# EAGLE design PowerOn (EAGLE 7.1.0)
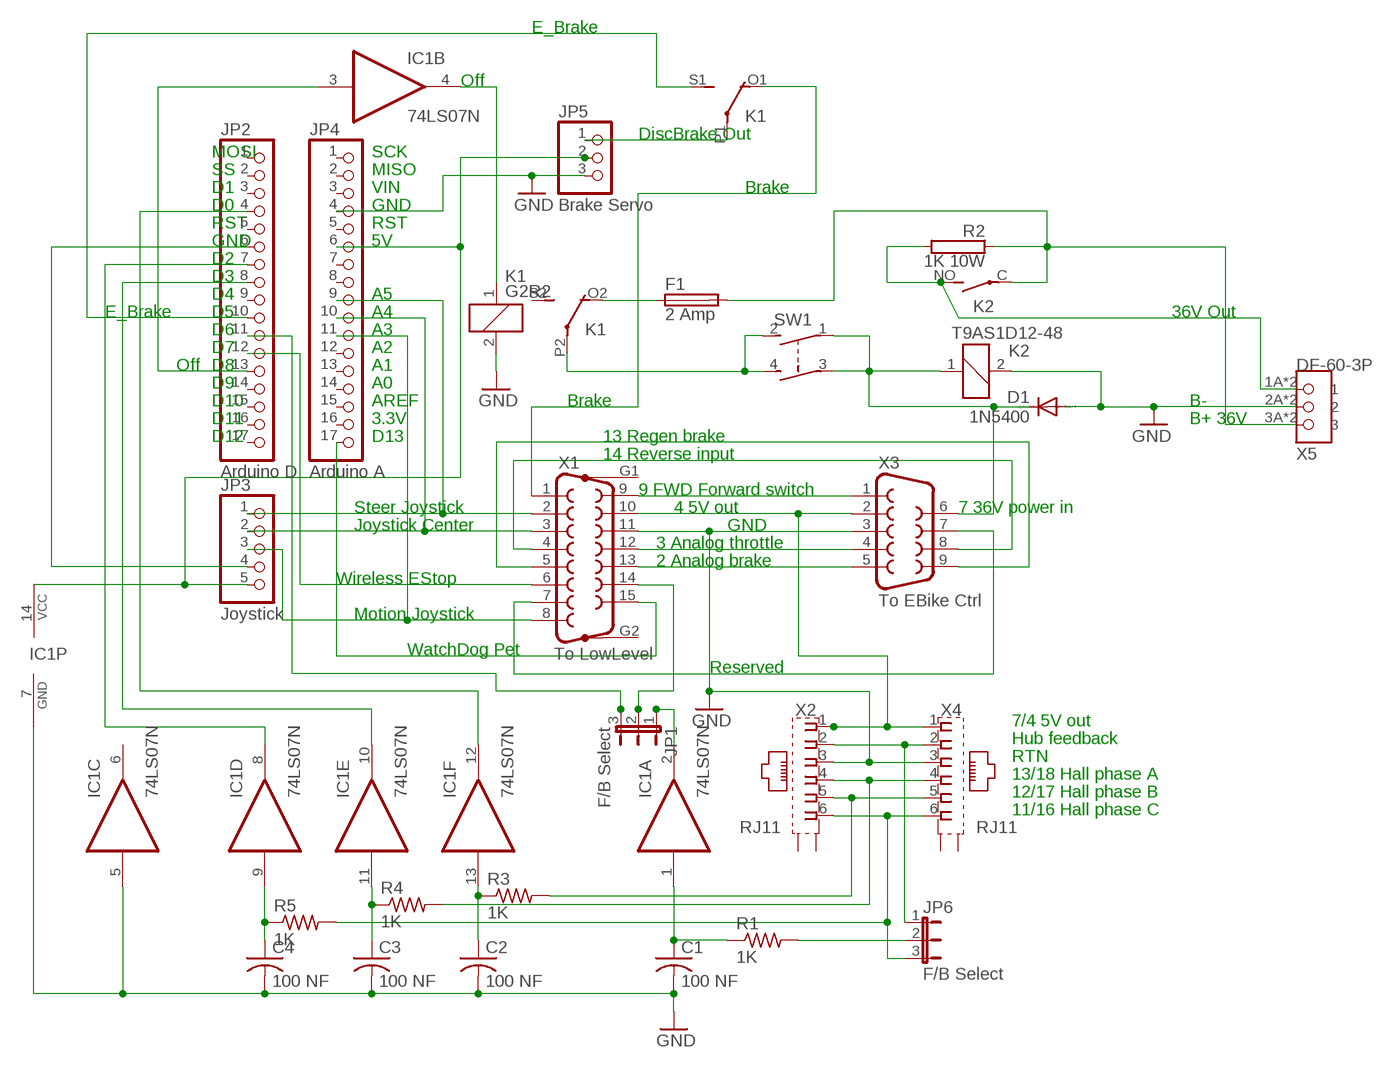
[diagram p0: schematic, sheet 1]

## Parts
C1  100 NF  C-US050-050X075  [C050-050X075]
C2  100 NF  C-US050-024X044  [C050-024X044]
C3  100 NF  C-US050-024X044  [C050-024X044]
C4  100 NF  C-US050-024X044  [C050-024X044]
D1  1N5400  [DO201-15]
F1  2 Amp  SH22,5  [SH22,5]
IC1  74LS07N  [DIL14]
JP1  F/B Select  JP2E  [JP2]
JP2  Arduino D  PINHD-1X17  [1X17]
JP3  Joystick  PINHD-1X5/90  [1X05/90]
JP4  Arduino A  PINHD-1X17  [1X17]
JP5  Brake Servo  PINHD-1X3/90  [1X03/90]
JP6  F/B Select  JP2E  [JP2]
K1  G2R2  [G2R2]
K2  T9AS1D12-48  JT1A-PCB-DC24V  [JT1A-PCB]
R1  1K  R-US_0411/15  [0411/15]
R2  1K 10W  RAC07  [AC07]
R3  1K  R-US_0207/10  [0207/10]
R4  1K  R-US_0207/10  [0207/10]
R5  1K  R-US_0207/10  [0207/10]
SW1  CK-S201  [CK-S201]
X1  To LowLevel  F15HP  [F15HP]
X2  RJ11  XRJK-S-01-6-6-0-2G2-NO  [XRJK-S-01-6-6-0-2G2-NO]
X3  To EBike Ctrl  F09H  [F09H]
X4  RJ11  XRJK-S-01-6-6-0-2G2-NO  [XRJK-S-01-6-6-0-2G2-NO]
X5  HIROSE-DF60-3P-10.16DSA  [DF-60-3P-10.16]

## Nets
36V_BAT: F1.2 K2.C(P) R2.1 X5.3A X5.3B
36V_CL: D1.C K2.1 SW1.1(P) SW1.3(P1) X3.6
36V_OUT: K2.NO(S) R2.2 X5.1A X5.1B
36V_SW: K1.P2(3:P) SW1.2(S) SW1.4(S1)
BRAKE: K1.O1(2:O) X1.1
BRK: X1.13 X3.5
BRK_OUT: JP5.1 K1.P1(2:P)
E_RQST: JP2.12 X1.6
EBRAKE: JP2.10 K1.S1(2:S)
F/B: JP1.2 X1.14
FB_SEL: JP6.2 R1.2
FWD: X1.9 X3.1
GND: C1.2 C2.2 C3.2 C4.2 D1.A IC1.5(C:I) IC1.7(P:GND) JP4.4 JP5.3 K1.2 K2.2 X1.11 X2.3 X3.3 X4.3 X5.2A X5.2B
GND2: JP2.6 JP3.4
HALLA: R4.2 X2.4 X4.4
HALLB: R3.2 X2.5 X4.5
HALLC: JP6.3 R5.2 X2.6 X4.6
JOY_CEN: JP3.2 JP4.10 X1.3
JOY_MOT: JP3.3 JP4.11 X1.8
JOY_STR: JP3.1 JP4.9 X1.2
LIVE: X1.10 X2.1 X3.2 X4.1
N$1: IC1.2(A:O) JP1.1
N$2: F1.1 K1.O2(3:O)
N$3: C2.1 IC1.13(F:I) R3.1
N$4: C3.1 IC1.11(E:I) R4.1
N$5: C4.1 IC1.9(D:I) R5.1
N$6: IC1.8(D:O) JP2.7
N$7: IC1.10(E:O) JP2.8
N$8: IC1.12(F:O) JP2.4
N$9: JP1.3 JP2.11
OFF: IC1.3(B:I) JP2.13
OFF_DRV: IC1.4(B:O) K1.1
RESERVE: X1.7 X3.7
REV: X1.4 X3.8
RGN: X1.5 X3.9
SPD: C1.1 IC1.1(A:I) R1.1
SPEED: JP6.1 X2.2 X4.2
THROT: X1.12 X3.4
VCC: IC1.14(P:VCC) JP3.5 JP4.6 JP5.2
WDOG: JP4.17 X1.15
Unconnected: IC1.6(C:O) JP2.1 JP2.2 JP2.3 JP2.5 JP2.9 JP2.14 JP2.15 JP2.16 JP2.17 JP4.1 JP4.2 JP4.3 JP4.5 JP4.7 JP4.8 JP4.12 JP4.13 JP4.14 JP4.15 JP4.16 K1.S2(3:S) X1.G1 X1.G2 X2.S1(S) X2.S2(S) X4.S1(S) X4.S2(S)

## Notes on the sheet
- E_Brake
- Off
- DiscBrake Out
- MOSI | SCK
- SS | MISO
- D1 | VIN | Brake
- D0 | GND
- RST | RST
- GND | 5V
- D2
- D3
- D4 | A5
- E_Brake | D5 | A4 | 36V Out
- D6 | A3
- D7 | A2
- Off | D8 | A1
- D9 | A0
- D10 | AREF | Brake | B-
- D11 | 3.3V | B+ 36V
- D12 | D13 | 13 Regen brake
- 14 Reverse input
- 9 FWD Forward switch
- Steer Joystick | 4 5V out | 7 36V power in
- Joystick Center | GND
- 3 Analog throttle
- 2 Analog brake
- Wireless EStop
- Motion Joystick
- WatchDog Pet
- Reserved
- 7/4 5V out
- Hub feedback
- RTN
- 13/18 Hall phase A
- 12/17 Hall phase B
- 11/16 Hall phase C

## Library data of the parts
C1-C4 = rcl:C-US: CAPACITOR, American symbol
D1 = diode:1N5400: DIODE standard rectifier, 3 A, 50 V (Motorola)
F1 = fuse:SH22,5: FUSE HOLDER grid 22,5 mm, OGN0031 8201, Schurter (Buerklin); MF: SCHURTER; MPN: 0031.8201; OC_FARNELL: 1162740; OC_NEWARK: 96F8317
IC1 = 74xx-us:74*07: Hex BUFFER, open collector high-voltage output
JP1 JP6 = jumper:JP2E: JUMPER
JP2 JP4 = pinhead:PINHD-1X17: PIN HEADER
JP3 = pinhead:PINHD-1X5: PIN HEADER
JP5 = pinhead:PINHD-1X3: PIN HEADER
K1 = relay:G2R2: RELAY 2 x switch, Omron; MF: OMRON COMPONENTS USA; MPN: G2R-2-DC6; OC_FARNELL: unknown; OC_NEWARK: 89C5317
K2 = relay:JT1A?-*: COMPACT ECONOMICAL 30 AMP. RELAY NAiS Source: http://www.mew-europe.com/.. en_ds_61212_0000.pdf; OC_FARNELL: unknown; OC_NEWARK: unknown
R1 R3-R5 = rcl:R-US_: RESISTOR, American symbol
R2 = resistor-power:R: Power Resitor; OC_FARNELL: unknown; OC_NEWARK: unknown
SW1 = elcanoParts:CK-S201: DPST Slider switch
X1 = con-subd:F15HP: SUB-D; OC_FARNELL: unknown; OC_NEWARK: unknown
X2 X4 = con-xmultiple:XRJK*6: RJ11 Connector without LED, 6 position, 6 contacts, shielded, thrue hole Source: XRJK-S-01-6-6-0-2G2-NO(01).pdf
X3 = con-subd:F09: SUB-D; OC_FARNELL: unknown; OC_NEWARK: unknown
X5 = elcanoParts:HIROSE-DF60-3P-10.16DSA: 3 pin, 45Amp, 10.16mm pitch, board to Wire connector (UL, C-UL, TÜV certified product)

## Board
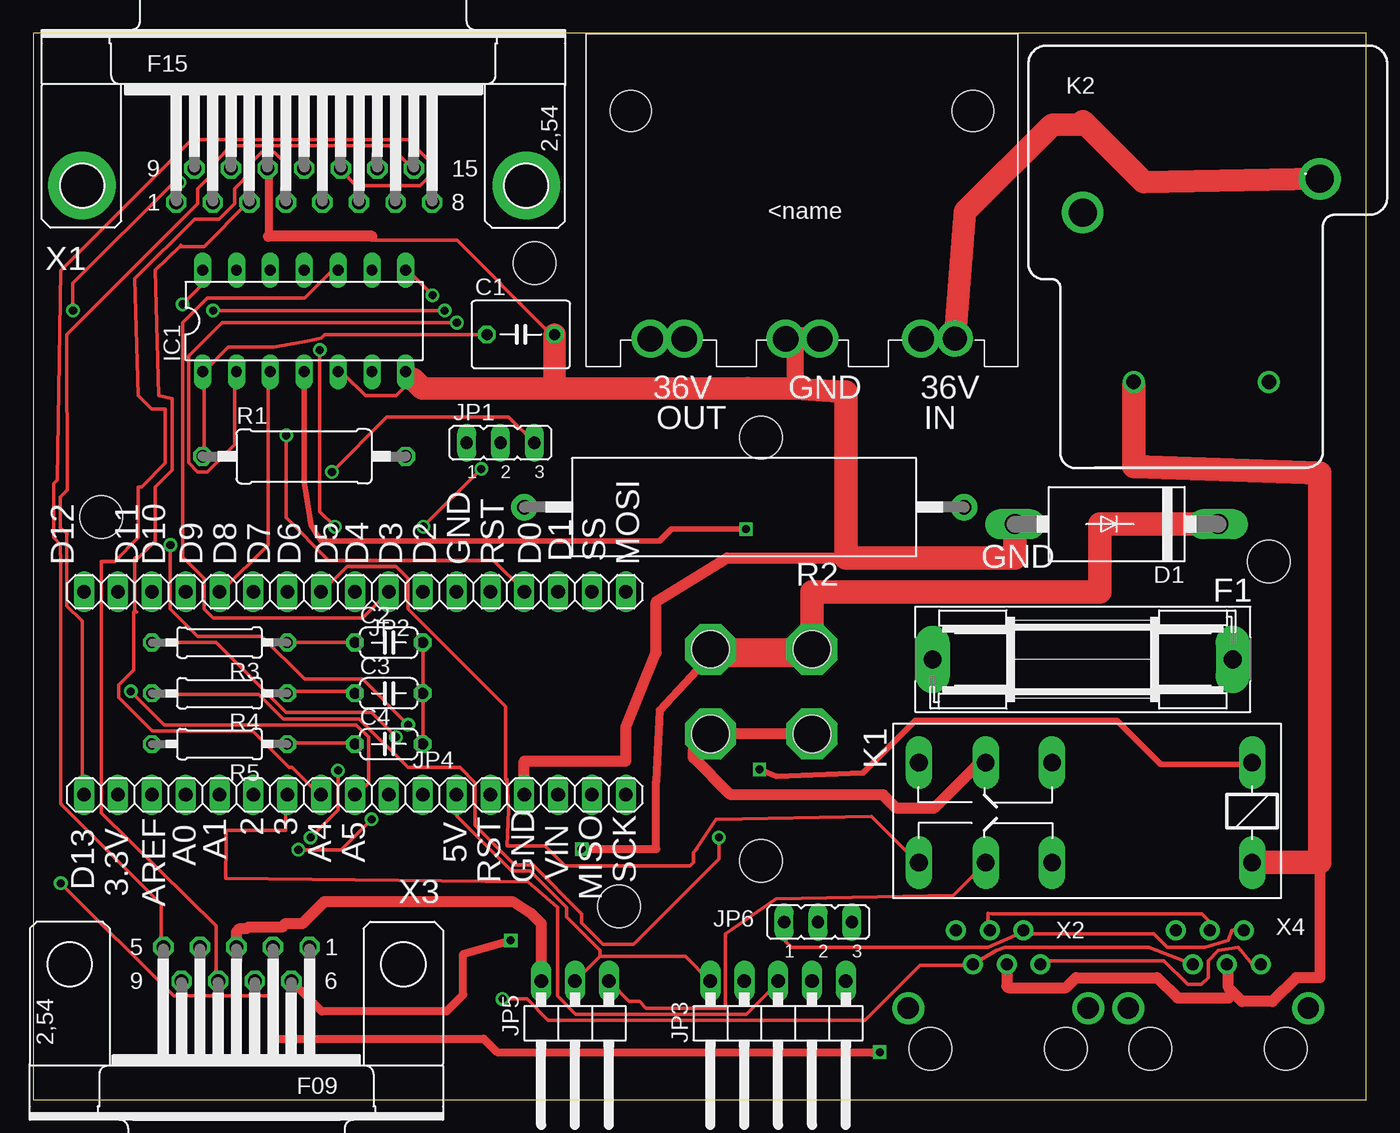
[diagram p1: board, top side]
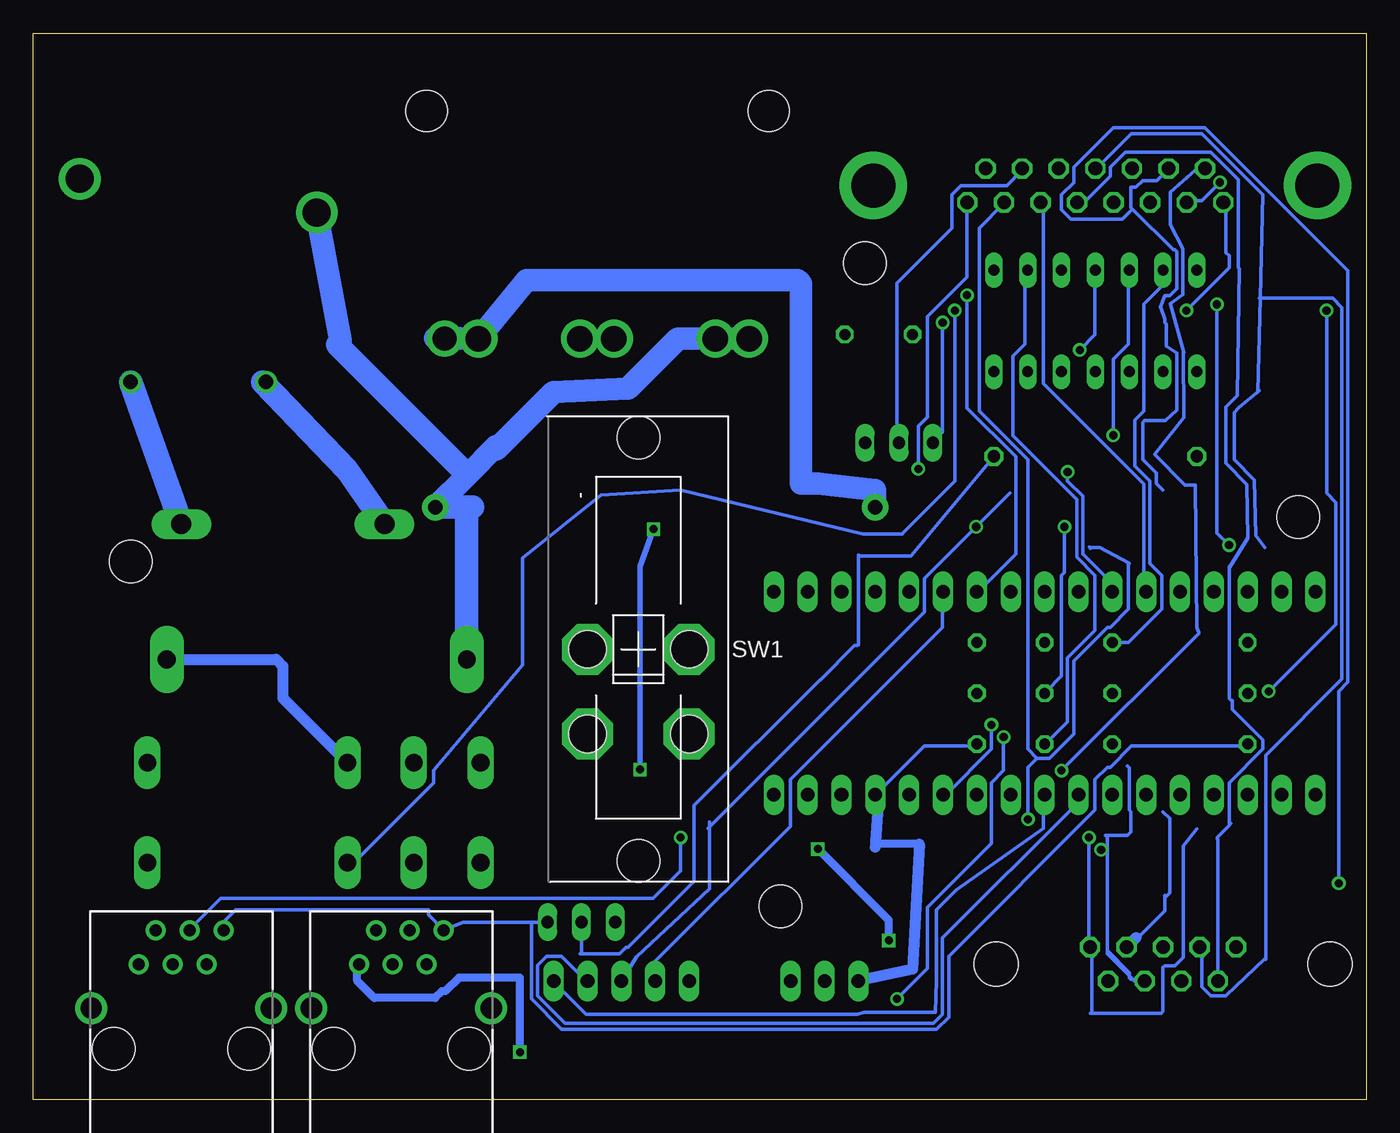
[diagram p2: board, bottom side, seen from below]

Size 100 x 80 mm. Coordinates in mm from the lower left corner, seen from the top.
Outline: 0,0 100,0 100,80 0,80 0,0
Copper layers (1*16): Top 0.035mm / dielectric 1.5mm / Bottom 0.035mm
Design rules "default": minimum track width 10mil, minimum drill 24mil, track to track 8mil, track to pad 8mil, pad to pad 8mil, via to via 8mil, smd to smd 8mil, copper to edge 40mil, drill to drill 8mil, minimum pad ring 10mil, minimum via ring 8mil, stop-mask expansion 4mil, vias tented up to drill 0mil, thermal gap 10mil
Holes 3.2 mm at 37.59,62.74 92.71,40.39 43.94,14.48 5.08,43.69

### Footprints (pad centres in the part's own frame; a part is rotated, then mirrored left to right if it is on the bottom)
C050-050X075 = drill 0.813 octagon: 1 -2.54,0; 2 2.54,0
C050-024X044 = drill 0.813 octagon: 1 -2.54,0; 2 2.54,0
DO201-15 = drill 1.499 long: A 7.62,0; C -7.62,0
SH22,5 = drill 1.321 pad 2.54 long: 1 -11.252,0; 2 11.252,0
DIL14 = drill 0.813 long: 1 -7.62,-3.81; 2 -5.08,-3.81; 3 -2.54,-3.81; 4 0,-3.81; 5 2.54,-3.81; 6 5.08,-3.81; 7 7.62,-3.81; 8 7.62,3.81; 9 5.08,3.81; 10 2.54,3.81; 11 0,3.81; 12 -2.54,3.81; 13 -5.08,3.81; 14 -7.62,3.81
JP2 = drill 0.914 long: 1 -2.54,0; 2 0,0; 3 2.54,0
1X17 = drill 1.016 long: 1 -20.32,0; 2 -17.78,0; 3 -15.24,0; 4 -12.7,0; 5 -10.16,0; 6 -7.62,0; 7 -5.08,0; 8 -2.54,0; 9 0,0; 10 2.54,0; 11 5.08,0; 12 7.62,0; 13 10.16,0; 14 12.7,0; 15 15.24,0; 16 17.78,0; 17 20.32,0
1X05/90 = drill 1.016 long: 1 -5.08,-3.81; 2 -2.54,-3.81; 3 0,-3.81; 4 2.54,-3.81; 5 5.08,-3.81
1X03/90 = drill 1.016 long: 1 -2.54,-3.81; 2 0,-3.81; 3 2.54,-3.81
G2R2 = drill 1.321 long: 1 -2.54,-3.683; 2 -2.54,3.81; O1 12.471,3.81; O2 12.471,-3.683; P1 17.45,3.81; P2 17.45,-3.683; S1 22.454,3.81; S2 22.454,-3.683
JT1A-PCB = drill 1.1: 1 5.08,0; 2 -5.08,0 | drill 2.1: C -8.89,12.7; NO 8.89,15.24
0411/15 = drill 0.914 octagon: 1 -7.62,0; 2 7.62,0
AC07 = drill 1.1 pad 2: 1 -16.5,0; 2 16.5,0
0207/10 = drill 0.813 octagon: 1 -5.08,0; 2 5.08,0
CK-S201 = drill 2.8 pad 3.81 octagon: 1 -3.81,0; 2 -3.81,-6.35; 3 3.81,0; 4 3.81,-6.35 | hole 3.2: 0,-15.875; 0,15.875 | hole 2.8: 3.81,-6.35; -3.81,-6.35; 3.81,0; -3.81,0
F15HP = drill 1.016 octagon: 1 -9.601,-1.27; 2 -6.858,-1.27; 3 -4.115,-1.27; 4 -1.372,-1.27; 5 1.372,-1.27; 6 4.115,-1.27; 7 6.858,-1.27; 8 9.601,-1.27; 9 -8.23,1.27; 10 -5.486,1.27; 11 -2.743,1.27; 12 0,1.27; 13 2.743,1.27; 14 5.486,1.27; 15 8.23,1.27 | drill 3.302 pad 5.08: G1 -16.662,0; G2 16.662,0
XRJK-S-01-6-6-0-2G2-NO = drill 0.9 pad 1.5: 1 -3.175,6.35; 2 -1.905,8.89; 3 -0.635,6.35; 4 0.635,8.89; 5 1.905,6.35; 6 3.175,8.89 | drill 1.6 pad 2.184: S1 -6.75,3.05; S2 6.75,3.05 | hole 3.2: -5.08,0; 5.08,0
F09H = drill 1.016 octagon: 1 -5.486,-1.27; 2 -2.743,-1.27; 3 0,-1.27; 4 2.743,-1.27; 5 5.486,-1.27; 6 -4.115,1.27; 7 -1.372,1.27; 8 1.372,1.27; 9 4.115,1.27 | hole 3.302: -12.522,0; 12.522,0
DF-60-3P-10.16 = drill 1.9: 1A 8.95,-11.5; 2A -1.21,-11.5; 2B 1.33,-11.5; 3A -11.37,-11.5; 3B -8.83,-11.5 | drill 1.8: 1B 11.49,-11.5 | hole 3.1: -12.835,5.6; 12.835,5.6

### Placement (x,y rotation side)
C1  36.58,57.4 0 top
C2  26.67,34.29 0 top
C3  26.67,30.48 0 top
C4  26.67,26.67 0 top
D1  81.28,43.18 180 top
F1  78.74,33.02 180 top
IC1  20.32,58.42 0 top
JP1  35.05,49.28 0 top
JP2  24.13,38.1 180 top
JP3  55.88,5.08 180 top
JP4  24.13,22.86 180 top
JP5  40.64,5.08 180 top
JP6  58.88,13.31 0 top
K1  88.9,21.59 180 top
K2  87.63,53.85 0 top
R1  20.32,48.26 0 top
R2  53.34,44.45 180 top
R3  13.97,34.29 180 top
R4  13.97,30.48 180 top
R5  13.97,26.67 180 top
SW1  54.61,33.78 0 bottom
X1  20.32,68.58 0 top
X2  72.39,3.81 0 bottom
X3  15.24,10.16 180 top
X4  88.9,3.81 0 bottom
X5  57.66,68.58 0 top

### Tracks (layer width: path | path; a pad name or v marks a point on that pad's centre or on a via)
36V_BAT
  Bottom 1.676: X5.3A X5.3B 51.63,57.08 55.37,53.34 60.96,53.09 65.28,48.77 65.27,49.02 67.43,46.86 | 67.43,46.86 R2.1 | 67.43,46.86 77.22,56.64 76.96,56.9 K2.C
  Bottom 1.778: F1.2 67.49,44.02 67.06,44.45 R2.1
36V_CL  (via drill 0.6)
  Top 0.61: 50.29,33.27 50.29,32.77 46.99,29.21 46.74,23.88 46.74,18.8 v41.15,18.8 | X3.6 21.64,6.6 30.99,6.6 32.26,7.87 32.26,10.92 v35.81,11.94
  Top 1.676: SW1.1 SW1.3 50.29,33.27 58.67,33.27 58.93,33.53 50.8,33.53
  Top 1.778: D1.C 80.01,43.18 80.01,38.1 58.42,38.1 SW1.1
  Bottom 0.61: v35.81,11.94 35.81,13.46 v41.15,18.8
  Bottom 1.778: K2.1 D1.C
36V_OUT
  Top 1.676: X5.1B 69.91,66.61 76.45,73.15 78.49,73.15 78.74,73.41 83.31,68.83 K2.NO
  Bottom 1.676: R2.2 36.84,45.73 41.15,46.23 42.42,46.23 42.42,61.21 42.67,61.47 62.98,61.47 X5.1A 68,57.08 68.07,57.15 69.84,57.15 X5.1B
36V_SW
  Top 0.813: K1.P2 70.99,25.27 67.56,21.84 64.77,21.84 63.75,22.86 52.32,22.86 49.53,25.65 49.53,26.16 SW1.4 SW1.2
BRAKE  (via drill 0.61)
  Top 0.254: v30.86,59.21 v13.49,59.21
  Bottom 0.254: v13.49,59.21 10.29,62.41 10.29,63.32 10.52,63.55 10.52,67.21 X1.1 | K1.O1 76.35,17.83 75.89,17.83 69.95,23.77 69.95,24.69 63.3,32.61 63.3,40.62 57.4,45.36 51.44,45.74 37.74,42.42 34.8,42.42 34.75,42.52 30.86,46.41 30.86,59.18 | v30.86,59.21 30.96,59.21 30.99,59.18 30.86,59.18 | 30.86,59.18 30.86,59.44
BRK
  Top 0.254: X3.5 9.6,11.43 9.6,14.63 2.06,22.17 2.06,40.87 2.03,40.89 2.03,41.66 1.52,42.16 1.52,46.23 1.78,46.48 2.06,62.18 11.89,72.01 28.12,72.01 29.72,70.41 29.72,69.27 29.03,68.58 24.23,68.58 23.09,69.72 X1.13
BRK_OUT
  Top 0.254: 43.2,8.91 JP5.1 44.7,7.37 45.47,7.37 45.97,6.86 51.94,6.86 51.94,12.45 55.7,15.06 69.04,15.32 71.32,17.6 K1.P1
E_RQST
  Bottom 0.254: JP2.12 16.69,38.18 16.69,46.18 24.23,53.72 24.23,67.21 X1.6
EBRAKE
  Top 0.254: 49.53,18.54 49.73,18.77 51.21,21.01 62.87,21.26 66.29,17.83 K1.S1 | 49.78,18.8 49.53,18.54 | 49.53,18.54 49.53,17.78 49.28,17.53 39.88,17.53 38.38,19.02 35.56,19.02 35.66,21.72 35.53,24 35.43,24 35.43,29.49 28.12,36.8 28.12,39.09 27.2,40.01 23.55,40.01 21.72,38.18 JP2.10 21.72,37.95
F/B
  Bottom 0.254: JP1.2 35.2,49.38 35.2,61.27 31.09,65.38 31.09,67.89 30.4,68.58 26.98,68.58 25.83,69.72 X1.14
FB_SEL
  Bottom 0.254: JP6.2 58.88,11.02 58.98,10.92 56.03,10.92 55.55,11.4 55.4,11.4 50.42,16.38 50.42,22.07 41,31.5 40.95,31.5 38.38,34.06 38.2,34.06 38.1,34.11 38.1,40.84 37.92,40.77 34.16,40.77 R1.2
FWD  (via drill 0.61)
  Top 0.254: v20.8,19.66 22.86,21.72 v22.86,24.69
  Bottom 0.254: X1.9 12.12,69.72 12.8,69.72 14.68,68.1 14.71,65.66 13.74,63.83 13.74,60.4 14.68,59.72 13.66,56.06 13.72,56.13 13.66,51.16 15.88,48.44 15.88,48.39 13.59,46.1 12.83,46.1 12.7,35.43 12.57,35.05 12.57,34.98 v22.86,24.69 | 12.7,20.32 13.72,19.05 13.72,10.67 14.35,10.03 15.11,10.03 15.24,9.91 15.24,6.6 15.37,6.48 20.7,6.48 20.57,6.6 20.57,11.43 X3.1 20.8,11.43 v20.8,19.66
GND
  Top 0.254: C4.2 29.26,26.75 29.26,30.4 C3.2 29.26,30.63 29.26,34.29 C2.2 | IC1.5 22.86,54.41 23.32,54.41 24.92,52.81 27.2,52.81 27.89,53.49 IC1.7 28.12,54.63 28.45,54.1 | K2.2 82.53,53.95 82.55,53.59 | 25.4,64.77 25.6,64.47 31.77,64.47 38.41,57.84 C1.2
  Top 0.61: X1.11 17.65,69.77 17.65,64.77
  Top 0.813: JP4.4 36.83,25.4 44.45,25.4 44.45,27.94 46.74,33.53 46.74,37.34 52.07,40.64 60.96,40.64 | 25.4,64.77 17.65,64.77 | JP5.3 38.1,13.21 37.34,13.97 35.94,14.86 21.84,14.86 20.19,13.21 18.92,13.21 18.67,12.95 16.13,12.95 16,12.83 15.49,12.83 15.24,12.57 X3.3 | 96.52,17.78 96.52,9.14 94.74,9.14 92.96,7.37 90.68,7.37 90.04,8 | 90.04,8 89.66,8.38 89.66,10.03 X4.3 | X2.3 73.03,8.51 73.15,8.38 77.47,8.38 78.23,9.14 84.33,9.14 85.85,7.62 89.66,7.62 90.04,8
  Top 1.27: 57.15,57.15 57.15,53.34 53.59,53.59
  Top 1.676: 60.96,53.09 57.15,53.34 39.62,53.34 | 59.44,57.15 59.11,57.08 X5.2B X5.2A 57.21,57.09 57.15,57.15 | 39.62,53.34 29.21,53.34 28.45,54.1 | C1.2 39.12,53.85 39.62,53.34
  Top 1.778: D1.A 73.66,40.64 60.96,40.64 60.96,53.09 | K1.2 96.52,17.78 96.52,46.99 82.55,47.5 82.55,53.59
  Bottom 0.254: C4.2 29.26,26.52 33.15,26.52 36.58,23.09 JP4.4
  Bottom 0.61: 33.53,19.18 36.64,19.18 36.8,19.34
  Bottom 0.813: JP4.4 arc90 36.58,22.61 36.8,19.34 36.83,18.92 | 33.53,19.18 34.04,9.78 JP5.3
  Bottom 1.676: K2.2 82.8,53.85
  Bottom 1.778: 82.8,53.85 76.45,47.24 D1.A
GND2
  Bottom 0.254: JP2.6 31.77,37.95 31.77,35.43 43.2,24 43.2,20.5 53.26,10.44 JP3.4
HALLA  (via drill 0.61)
  Top 0.254: X4.4 88.14,12.83 88.14,13.46 87.66,13.95 71.91,13.95 71.63,13.97 71.63,12.83 X2.4 | v51.44,19.66 51.44,18.06 45.03,11.66 42.75,11.66 41.15,13.26 41.15,13.95 37.49,17.6 36.12,17.6 33.15,20.57 33.15,23.77 32,24.92 28.12,24.92 24.46,28.57 18.75,28.57 16.92,30.4 8.91,30.4 R4.2
  Bottom 0.254: v51.44,19.66 51.44,17.14 53.49,15.09 85.95,15.09 88.24,12.8 X4.4
HALLB  (via drill 0.61)
  Top 0.254: X4.5 83.69,11.43 72.9,11.43 72.26,11.18 X2.5 70.41,10.06 66.52,10.06 62.41,5.94 38.63,5.94 37.03,7.54 v35.2,7.54 | R3.2 13.72,34.29 18.97,29.03 25.38,29.03 v27.2,27.2
  Bottom 0.254: v27.2,27.2 27.2,24.69 28.12,23.77 28.12,19.2 32.92,14.4 32.92,9.83 v35.2,7.54
HALLC
  Bottom 0.254: JP6.3 62.64,13.31 | 62.64,13.31 67.74,13.31 69.19,12.72 69.27,12.8 X2.6 70.36,13.84 70.36,14.22 84.84,14.22 85.72,13.34 X4.6 | 62.64,13.31 62.64,7.54 60.35,5.26 32.23,5.26 31.32,6.17 31.32,10.74 20.34,21.72 20.34,24 19.43,24.92 19.2,24.92 17.6,26.52 8.91,26.52 R5.2
JOY_CEN
  Top 0.254: 7.77,36.58 7.62,36.58 | 7.62,36.58 7.62,40.64 7.87,40.64 9.14,41.91 9.14,45.97 10.41,47.24 10.41,52.58 9.4,52.83 | 9.4,53.34 9.4,52.83 | 9.4,52.83 9.14,62.23 10.97,64.01 | 10.97,64.01 11.07,64.11 | X1.3 16,67.21 12.8,64.01 10.97,64.01 | 7.62,36.58 7.54,36.58 7.54,32.23 6.4,31.09 6.4,30.18 8.91,27.66 16.46,27.66 19.2,24.92 19.43,24.92 21.49,22.86 JP4.10
  Bottom 0.254: JP3.2 58.52,8.91 60.35,10.74 61.49,10.74 62.18,10.06 62.18,7.77 60.12,5.71 32.46,5.71 31.77,6.4 31.77,12.12 21.72,22.17 21.72,22.86 JP4.10
JOY_MOT  (via drill 0.61)
  Top 0.254: JP3.3 55.78,8.69 53.49,6.4 40.69,6.4 39.32,7.77 39.32,14.4 37.13,16.33 14.43,16.59 14.48,19.18 14.48,20.19 18.92,20.19 18.92,22.86 JP4.11 | v29.26,42.98 v33.6,47.32
  Bottom 0.254: 26.75,45.49 v29.26,42.98 33.15,39.09 33.15,36.58 49.38,20.34 49.28,20.34 | 49.28,20.34 49.28,15.8 54.76,10.69 JP3.3 | 49.28,20.34 49.28,20.83 | 29.72,67.21 X1.8 29.95,67.21 29.95,61.72 32.92,58.75 32.92,51.21 33.6,50.52 v33.6,47.32
JOY_STR  (via drill 0.61)
  Top 0.254: v10.97,68.81 10.52,68.81 2.97,61.27 v2.97,59.21 | v7.32,30.63 9.83,28.12 24.23,28.12 25.15,27.2 25.15,23.77 24.23,22.86 JP4.9
  Bottom 0.254: JP3.1 60.81,8.69 58.52,6.4 38.18,6.4 37.67,6.53 32.33,6.53 32.26,8.89 32.26,14.22 30.73,15.75 24.23,20.34 24.23,22.86 JP4.9 | v10.97,68.81 12.34,67.44 13.26,67.44 X1.2 | v2.97,59.21 2.97,45.49 2.29,44.81 2.29,35.66 v7.32,30.63
LIVE  (via drill 0.6, 0.61)
  Top 0.254: X4.1 91.44,10.16 90.42,11.43 88.9,11.18 88.14,10.41 88.14,9.14 87.63,8.64 86.61,8.64 84.84,10.41 75.82,10.41 X2.1 | 17.98,7.77 10.52,7.77 v2.06,16.23
  Top 0.61: X3.2 17.98,7.77 17.98,4.88 18.29,4.57 33.78,4.57 34.8,3.56 v63.5,3.56
  Bottom 0.254: 15.24,21.59 14.73,21.08 14.73,15.49 14.99,15.24 15.09,15.32 15.09,14.17 16.92,12.34 17.27,12.14 | 15.24,45.72 15.75,46.23 15.75,46.99 16.76,48.01 16.76,50.8 16.64,50.93 15.06,50.93 14.22,51.74 14.22,56.01 14.99,56.52 14.99,58.17 15.11,58.29 15.11,58.55 15.42,59.41 15.44,59.46 15.11,60.33 14.73,60.33 14.22,60.83 14.22,63.63 14.35,63.75 14.48,63.75 17.54,66.81 | 17.54,66.81 17.65,66.93 17.65,68.45 17.27,68.45 16.76,68.96 15.72,68.96 X1.10 | v2.06,16.23 2.06,30.63 1.37,31.32 1.37,62.18 12.12,72.92 18.97,72.92 21.95,69.95 21.95,68.81 22.86,67.89 22.86,66.75 22.17,66.06 18.29,66.06 17.54,66.81
  Bottom 0.61: v63.5,3.56 63.5,9.14 68.07,9.14 69.09,8.13 69.34,8.13 69.85,7.62 74.42,7.62 75.69,8.89 75.69,10.03 X2.1
  Bottom 0.813: 17.27,12.14 X3.2
N$1  (via drill 0.61)
  Top 0.254: v31.77,58.29 14.17,58.29 11.66,55.78 11.66,47.78 12.34,47.09 13.03,47.09 15.09,49.15 15.09,54.41 IC1.2
  Bottom 0.254: v31.77,58.29 31.77,50.06 32.46,49.38 JP1.1
N$2
  Bottom 0.813: F1.1 81.79,33.02 81.28,32.51 81.28,30.12 K1.O2
N$3
  Top 0.254: C2.1 R3.1
  Bottom 0.254: R3.1 17.83,34.29 15.32,36.8 15.32,39.32 16.23,40.23 16.23,46.41 17.37,47.55 17.37,50.98 16.69,51.66 16.69,59.66 15.32,61.04 15.32,62.18 IC1.13
N$4  (via drill 0.61)
  Top 0.254: R4.1 19.2,30.63 24,30.63 C3.1 | v21.49,56.24 21.49,44.12 v22.63,42.98
  Bottom 0.254: v21.49,56.24 20.34,57.38 20.34,62.18 IC1.11 | v22.63,42.98 22.63,39.55 22.86,39.32 22.86,31.77 24,30.63 C3.1
N$5
  Top 0.254: R5.1 19.2,26.75 24,26.75 C4.1
  Bottom 0.254: IC1.9 25.6,62.18 25.6,56.69 26.52,55.78 26.52,49.84 21.72,45.03 21.72,40.69 20.34,39.32 20.34,35.2 22.4,33.15 22.4,28.35 24,26.75 C4.1
N$6  (via drill 0.61)
  Top 0.254: v29.95,60.35 28.12,62.18 IC1.8
  Bottom 0.254: v29.95,60.35 29.95,51.89 26.29,48.23 26.29,40.92 29.03,38.18 JP2.7
N$7
  Top 0.254: JP2.8 24.69,36.12 13.49,36.12 12.8,36.8 12.8,39.09 11.2,40.69 11.2,58.29 13.03,60.12 20.34,60.12 22.4,62.18 22.86,62.18 IC1.10
N$8  (via drill 0.61)
  Top 0.254: v18.97,49.84 18.97,43.66 22.17,40.46 34.52,40.46 36.8,38.18 JP2.4
  Bottom 0.254: v18.97,49.84 18.97,55.55 17.83,56.69 17.83,62.18 IC1.12
N$9  (via drill 0.61)
  Top 0.254: JP1.3 35.66,51.21 26.52,51.21 v22.4,47.09
  Bottom 0.254: v22.4,47.09 22.4,46.41 21.26,45.26 21.26,40.92 19.2,38.86 19.2,38.18 JP2.11
OFF
  Top 0.254: IC1.3 17.6,54.41 17.6,41.6 14.17,38.18 JP2.13
OFF_DRV  (via drill 0.6)
  Top 0.406: v91.44,25.15 84.58,25.15 81.28,28.45 66.17,28.45 62.23,24.51 55.75,24.26 v54.48,24.77 | v53.47,42.8 47.88,42.8 46.99,41.91 21.59,41.91 20.83,43.05 20.32,46.35 IC1.4
  Bottom 0.406: K1.1 v91.44,25.15 | v54.48,24.77 54.48,40.01 v53.47,42.8
RESERVE  (via drill 0.61)
  Top 0.254: 17.14,8.91 16.69,8.91 X3.7 | v19.89,18.75 23.09,18.75 v25.38,21.03
  Bottom 0.254: 20.7,41.35 20.77,41.45 20.72,41.4 19.96,41.4 17.82,40.26 | X1.7 27.2,67.21 29.03,65.38 29.03,51.66 25.38,48.01 25.38,26.29 24.69,25.6 | 19.43,11.18 19.43,10.92 17.14,8.64 16.89,8.64 16.64,8.89 16.76,9.02 | 16.76,9.02 17.65,9.02 17.78,9.14 17.78,9.53 19.43,11.18 | 19.43,11.18 19.43,18.75 | 19.43,18.75 19.43,19.68 19.56,19.81 17.91,19.81 17.65,20.07 17.65,21.59 17.78,21.72 17.78,24.89 17.91,25.02 | 17.78,40.23 17.82,40.26 | X3.7 16.69,8.91 16.76,9.02 | 24.69,25.6 23.77,25.6 21.95,27.43 21.95,32.92 19.43,35.43 19.2,35.43 17.83,36.8 17.83,40.23 17.82,40.26 | v19.89,18.75 19.43,18.75 | v25.38,21.03 25.38,24.92 24.69,25.6
REV
  Top 0.254: X3.8 13.72,8.91 13.72,13.03 5.08,21.51 5.08,40.39 6.1,40.39 7.87,42.16 7.87,45.97 8.13,45.97 9.91,47.75 9.91,51.82 8.89,51.82 7.87,52.83 7.62,61.59 12.09,66.06 13.95,66.06 15.09,67.21 15.09,68.35 16.46,69.72 16.46,70.41 17.14,71.09 18.06,71.09 18.75,70.41 18.75,67.44 X1.4
RGN
  Bottom 0.254: X1.5 21.49,67.44 21.03,67.44 19.2,69.27 19.2,69.95 18.06,71.09 11.66,71.09 9.6,69.04 9.6,62.41 9.53,62.33 9.65,52.83 10.54,51.94 10.54,47.75 8.94,46.13 8.89,42.11 10.22,39.96 | X3.9 11.12,19.51 11.18,19.56 11.18,19.68 10.29,20.57 | 10.29,20.57 10.16,20.7 | 10.24,39.93 10.22,39.96 | 10.22,39.96 10.29,40.01 10.29,30.1 10.16,29.97 10.06,29.95 10.06,29.26 7.77,26.98 7.77,26.29 10.29,23.77 10.29,20.57
SPD
  Top 0.254: R1.1 12.8,48.46 12.8,54.41 IC1.1 12.8,54.63 14.63,56.46 18.03,56.46 20.57,56.9 21.59,57.15 21.84,57.4 C1.1
SPEED
  Top 0.254: JP6.1 55.88,12.85 55.88,12.45 56.9,11.43 71.63,11.43 74.3,12.57 X2.2 74.55,12.45 84.07,12.45 85.09,11.43 87.88,11.43 89.66,11.94 89.92,12.7 X4.2
  Bottom 0.254: JP6.1 56.34,13.99
THROT
  Bottom 0.254: 7.96,60.12 7.77,67.89 12.34,72.47 17.6,72.47 20.12,69.95 X1.12 | 7.96,60.12 8.13,53.09 8.03,53.19 9.55,51.92 9.91,51.56 9.91,48.01 8.38,46.48 8.28,42.32 7.62,41.4 | X3.4 12.34,11.43 12.34,8.46 11.66,7.77 10.52,7.77 7.62,10.54 7.54,10.52 7.54,25.83 1.83,31.55 1.83,59.44 2.52,60.12 8,60.12 7.96,60.12
VCC  (via drill 0.61)
  Top 0.254: 42.52,10.74 40.69,8.91 JP5.2 | 42.52,10.74 48.92,10.74 50.75,8.91 JP3.5 | v11.2,59.66 12.57,61.04 12.57,62.18 IC1.14 | v10.29,41.6 10.29,36.8 12.34,34.75 17.14,34.75 20.34,31.55 24.69,31.55 v28.12,28.12 | 42.52,10.74 42.52,11.2 40.01,13.72 40.01,14.4 37.26,17.14 35.89,17.14 31.77,21.26 31.77,22.86 JP4.6
  Bottom 0.254: v11.2,59.66 11.2,42.52 v10.29,41.6 | v28.12,28.12 28.12,26.29 31.55,22.86 JP4.6
WDOG
  Top 0.254: JP4.17 3.66,22.86 3.66,35.89 2.52,37.03 2.52,42.39 2.54,42.42 2.03,42.93 2.03,45.21 2.54,45.72 2.52,57.38 12.34,67.21 12.34,68.35 13.72,69.72 13.72,70.41 14.86,71.55 26.75,71.55 28.35,69.95 X1.15

### Text on the board
tNames: 36V | GND | 36V | OUT | IN | D12 | D11 | D10 | D9 | D8 | D7 | D6 | D5 | D4 | D3 | D2 | GND | RST | D0 | D1 | SS | MOSI | GND | 2 | 3 | A0 | A1 | A4 | A5 | 5V | VIN | D13 | RST | GND | SCK | 3.3V | MISO | AREF